# Altium schematic sheet [03]_Actuators Driver Sheet.SchDoc
size 558 x 330 mm; DocumentNumber: 3; SheetNumber: 3; SheetTotal: 5
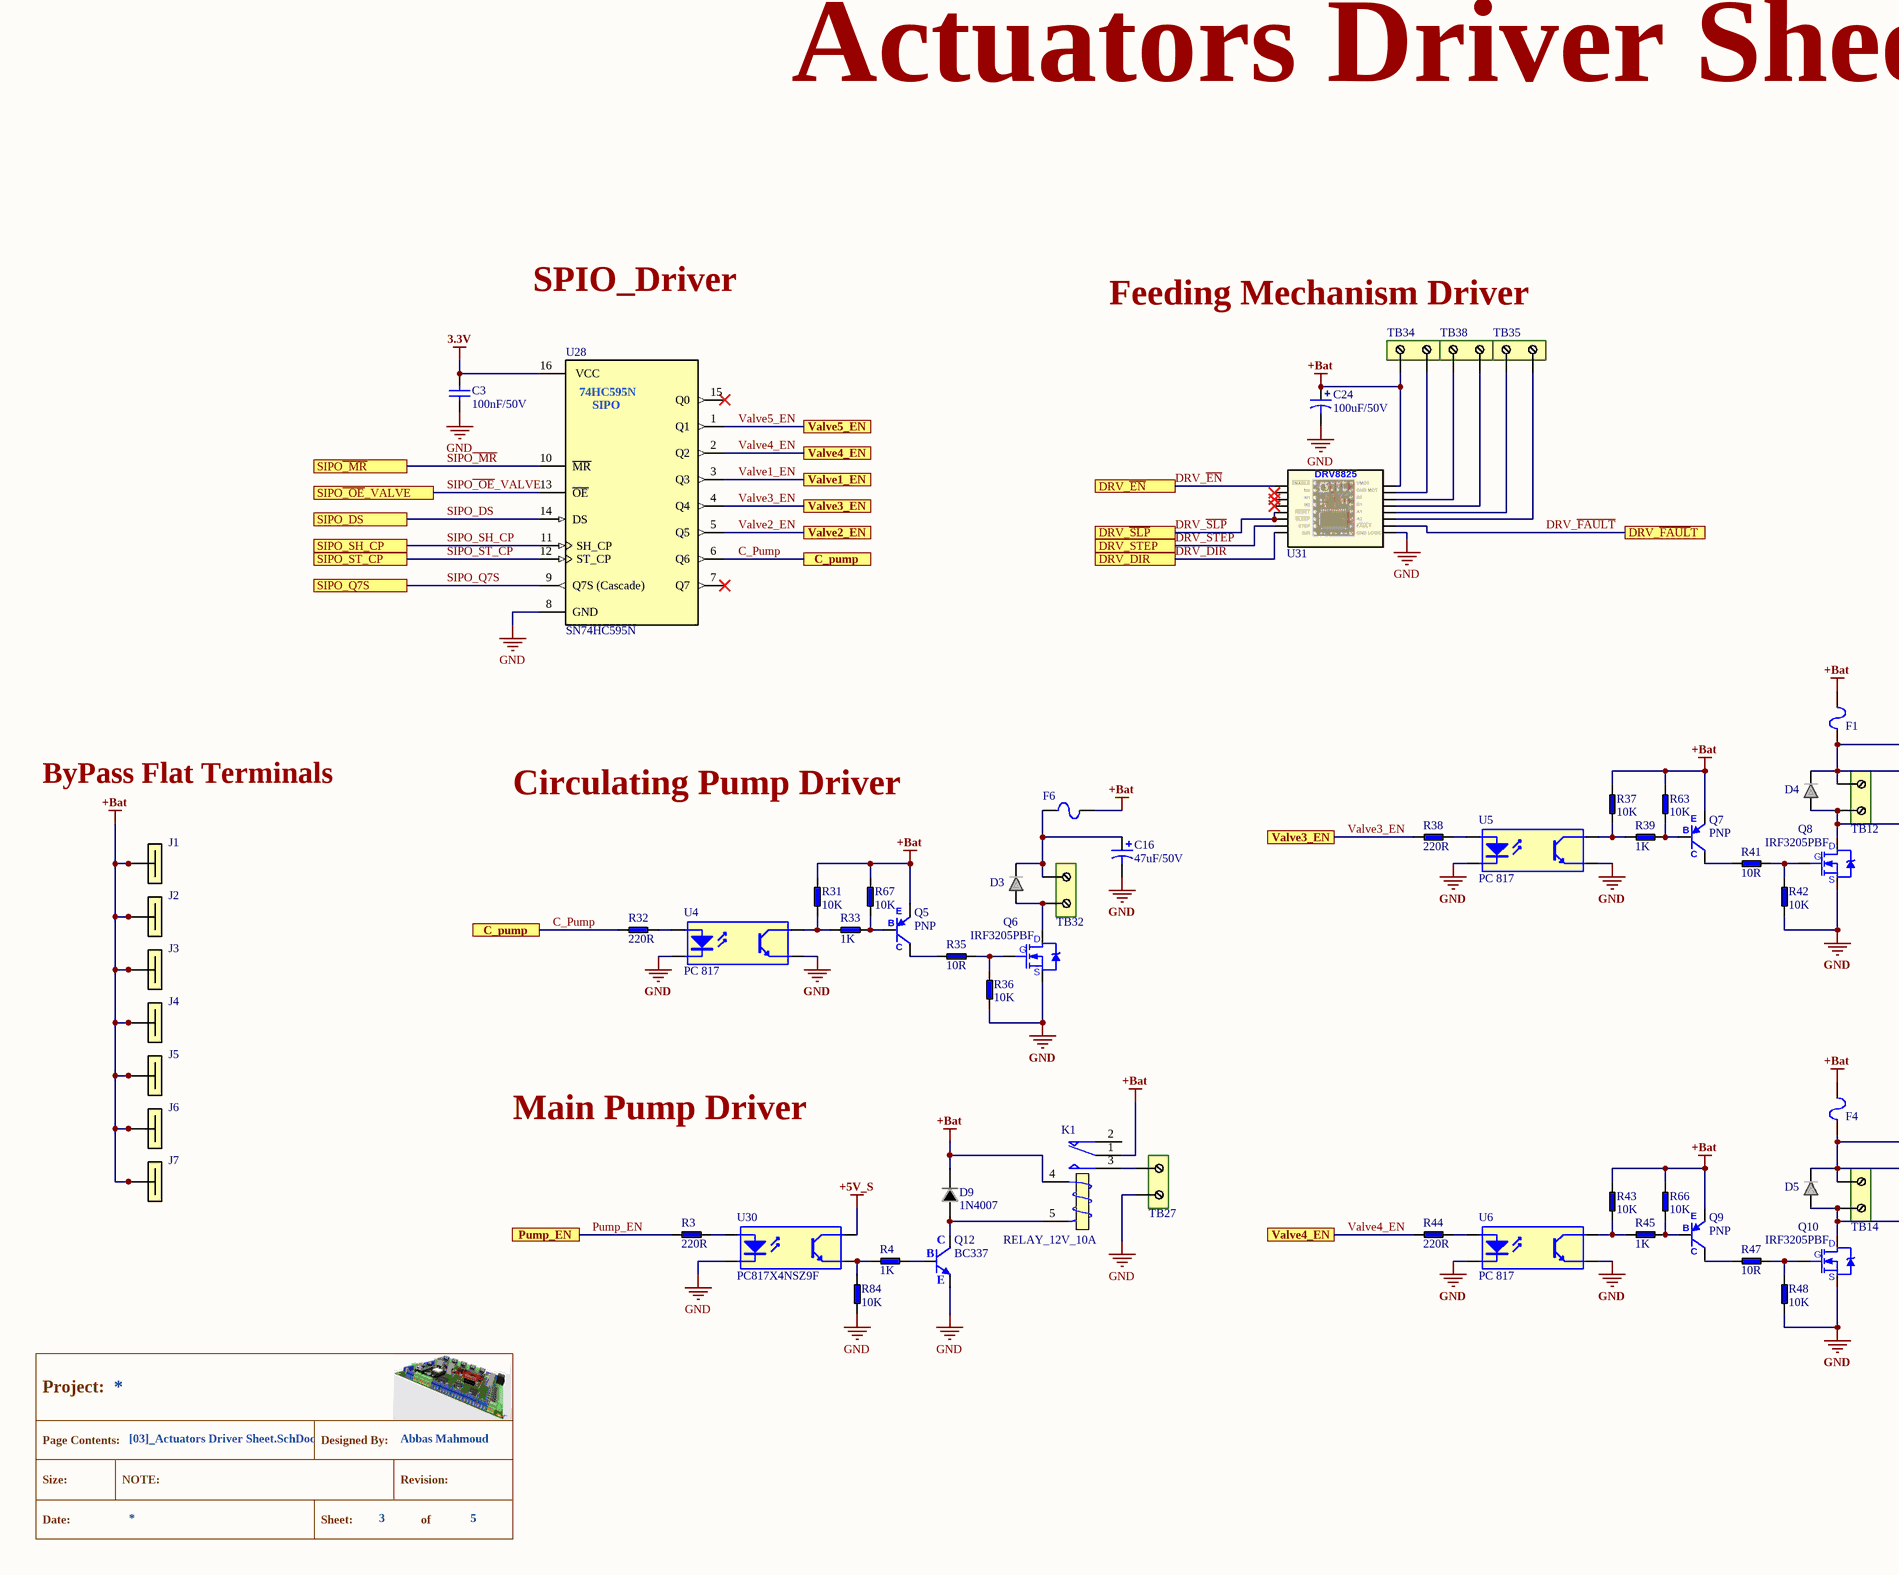
[diagram p0: [03]_Actuators Driver Sheet.SchDoc, left]
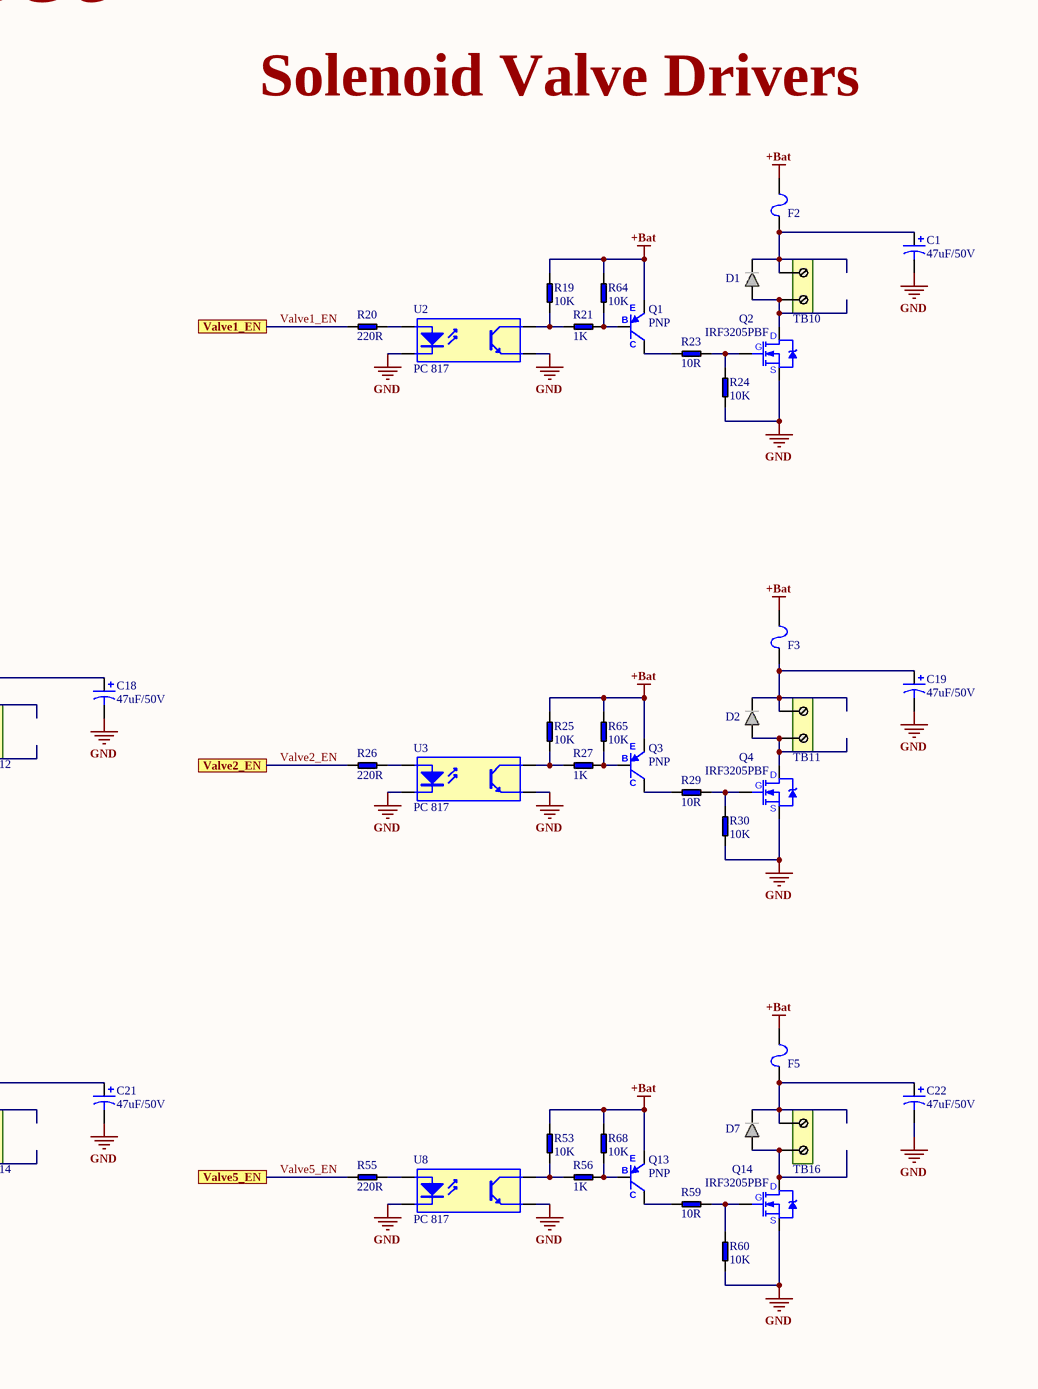
[diagram p1: [03]_Actuators Driver Sheet.SchDoc, right]

## Parts
*  Title Block  (value not drawn)  (graphical)
C1  47uF/50V  [ECAP - THT - 6.3X11X2.5MM]
C3  100nF/50V  [CCAP - PACKAGE - THT ,P = 2.54 MM]
C16  47uF/50V  [ECAP - THT - 6.3X11X2.5MM]
C18  47uF/50V  [ECAP - THT - 6.3X11X2.5MM]
C19  47uF/50V  [ECAP - THT - 6.3X11X2.5MM]
C21  47uF/50V  [ECAP - THT - 6.3X11X2.5MM]
C22  47uF/50V  [ECAP - THT - 6.3X11X2.5MM]
C24  100uF/50V  [ECAP - THT - 8X12X3.5MM]
D1  DIODE  [DIODE-1n400X_0.3]  (value not drawn)
D2  DIODE  [DIODE-1n400X_0.3]  (value not drawn)
D3  DIODE  [DIODE-1n400X_0.3]  (value not drawn)
D4  DIODE  [DIODE-1n400X_0.3]  (value not drawn)
D5  DIODE  [DIODE-1n400X_0.3]  (value not drawn)
D7  DIODE  [DIODE-1n400X_0.3]  (value not drawn)
D9  1N4007  [DIODE - THT - 7.62P - PACKAGE - DO-41]
F1  FUSES&HOLDERS  [FUSE-BLX-A HOLDER]  (value not drawn)
F2  FUSES&HOLDERS  [FUSE-BLX-A HOLDER]  (value not drawn)
F3  FUSES&HOLDERS  [FUSE-BLX-A HOLDER]  (value not drawn)
F4  FUSES&HOLDERS  [FUSE-BLX-A HOLDER]  (value not drawn)
F5  FUSES&HOLDERS  [FUSE-BLX-A HOLDER]  (value not drawn)
F6  FUSES&HOLDERS  [FUSE-BLX-A HOLDER]  (value not drawn)
J1  1217861-1  [Terminal Male Flat 6.3mm]  (value not drawn)
J2  1217861-1  [Terminal Male Flat 6.3mm]  (value not drawn)
J3  1217861-1  [Terminal Male Flat 6.3mm]  (value not drawn)
J4  1217861-1  [Terminal Male Flat 6.3mm]  (value not drawn)
J5  1217861-1  [Terminal Male Flat 6.3mm]  (value not drawn)
J6  1217861-1  [Terminal Male Flat 6.3mm]  (value not drawn)
J7  1217861-1  [Terminal Male Flat 6.3mm]  (value not drawn)
K1  RELAY_12V_10A  [RELAY - THT - 10A]
Q1  PNP  [Transistor-TO-92A]
Q2  IRF3205PBF  [Transistor/Heatsink -TO-220]
Q3  PNP  [Transistor-TO-92A]
Q4  IRF3205PBF  [Transistor/Heatsink -TO-220]
Q5  PNP  [Transistor-TO-92A]
Q6  IRF3205PBF  [Transistor/Heatsink -TO-220]
Q7  PNP  [Transistor-TO-92A]
Q8  IRF3205PBF  [Transistor/Heatsink -TO-220]
Q9  PNP  [Transistor-TO-92A]
Q10  IRF3205PBF  [Transistor/Heatsink -TO-220]
Q12  BC337  [Transistor - THT - PACKAGE - TO-92 / TO-92-3]
Q13  PNP  [Transistor-TO-92A]
Q14  IRF3205PBF  [Transistor/Heatsink -TO-220]
R3  220R  [R - THT - P5.0 - 1/4W]
R4  1K  [R - THT - P5.0 - 1/4W]
R19  10K  [R-THT_5.08mm-1/4W]
R20  220R  [R-THT_5.08mm-1/4W]
R21  1K  [R-THT_5.08mm-1/4W]
R23  10R  [R-THT_5.08mm-1/4W]
R24  10K  [R-THT_5.08mm-1/4W]
R25  10K  [R-THT_5.08mm-1/4W]
R26  220R  [R-THT_5.08mm-1/4W]
R27  1K  [R-THT_5.08mm-1/4W]
R29  10R  [R-THT_5.08mm-1/4W]
R30  10K  [R-THT_5.08mm-1/4W]
R31  10K  [R-THT_5.08mm-1/4W]
R32  220R  [R-THT_5.08mm-1/4W]
R33  1K  [R-THT_5.08mm-1/4W]
R35  10R  [R-THT_5.08mm-1/4W]
R36  10K  [R-THT_5.08mm-1/4W]
R37  10K  [R-THT_5.08mm-1/4W]
R38  220R  [R-THT_5.08mm-1/4W]
R39  1K  [R-THT_5.08mm-1/4W]
R41  10R  [R-THT_5.08mm-1/4W]
R42  10K  [R-THT_5.08mm-1/4W]
R43  10K  [R-THT_5.08mm-1/4W]
R44  220R  [R-THT_5.08mm-1/4W]
R45  1K  [R-THT_5.08mm-1/4W]
R47  10R  [R-THT_5.08mm-1/4W]
R48  10K  [R-THT_5.08mm-1/4W]
R53  10K  [R-THT_5.08mm-1/4W]
R55  220R  [R-THT_5.08mm-1/4W]
R56  1K  [R-THT_5.08mm-1/4W]
R59  10R  [R-THT_5.08mm-1/4W]
R60  10K  [R-THT_5.08mm-1/4W]
R63  10K  [R-THT_5.08mm-1/4W]
R64  10K  [R-THT_5.08mm-1/4W]
R65  10K  [R-THT_5.08mm-1/4W]
R66  10K  [R-THT_5.08mm-1/4W]
R67  10K  [R-THT_5.08mm-1/4W]
R68  10K  [R-THT_5.08mm-1/4W]
R84  10K  [R - THT - P5.0 - 1/4W]
TB10  2 Pins Pluggable  [TERMINAL BLOCK - 2 PINS - PACKAGE - PLUGGABLE - THT - P = 5.08MM - Horizontal _ Plug+Receptable]  (value not drawn)
TB11  2 Pins Pluggable  [TERMINAL BLOCK - 2 PINS - PACKAGE - PLUGGABLE - THT - P = 5.08MM - Horizontal _ Plug+Receptable]  (value not drawn)
TB12  2 Pins Pluggable  [TERMINAL BLOCK - 2 PINS - PACKAGE - PLUGGABLE - THT - P = 5.08MM - Horizontal _ Plug+Receptable]  (value not drawn)
TB14  2 Pins Pluggable  [TERMINAL BLOCK - 2 PINS - PACKAGE - PLUGGABLE - THT - P = 5.08MM - Horizontal _ Plug+Receptable]  (value not drawn)
TB16  2 Pins Pluggable  [TERMINAL BLOCK - 2 PINS - PACKAGE - PLUGGABLE - THT - P = 5.08MM - Horizontal _ Plug+Receptable]  (value not drawn)
TB27  2 Pins Pluggable  [TERMINAL BLOCK - 2 PINS - PACKAGE - PLUGGABLE - THT - P = 5.08MM - Horizontal _ Plug+Receptable]  (value not drawn)
TB32  2 Pins Pluggable  [TERMINAL BLOCK - 2 PINS - PACKAGE - PLUGGABLE - THT - P = 5.08MM - Horizontal _ Plug+Receptable]  (value not drawn)
TB34  2 Pins Pluggable  [TERMINAL BLOCK - 2 PINS - PACKAGE - PLUGGABLE - THT - P = 5.08MM - Horizontal _ Plug+Receptable]  (value not drawn)
TB35  2 Pins Pluggable  [TERMINAL BLOCK - 2 PINS - PACKAGE - PLUGGABLE - THT - P = 5.08MM - Horizontal _ Plug+Receptable]  (value not drawn)
TB38  2 Pins Pluggable  [TERMINAL BLOCK - 2 PINS - PACKAGE - PLUGGABLE - THT - P = 5.08MM - Horizontal _ Plug+Receptable]  (value not drawn)
U2  PC 817  [IC_DIP4]
U3  PC 817  [IC_DIP4]
U4  PC 817  [IC_DIP4]
U5  PC 817  [IC_DIP4]
U6  PC 817  [IC_DIP4]
U8  PC 817  [IC_DIP4]
U28  SN74HC595N  [ICB - DIP-16]
U30  PC817X4NSZ9F  [ICB - DIP-4]
U31  DRV8825  [drv8825]  (value not drawn)

## Ports
C_pump, DRV_DIR, DRV_STEP, DRV_~{EN}, DRV_~{FAUL}T, DRV_~{SLP}, Pump_EN, SIPO_DS, SIPO_Q7S, SIPO_SH_CP, SIPO_ST_CP, SIPO~{_MR}, SIPO~{_OE}_VALVE, Valve1_EN, Valve2_EN, Valve3_EN, Valve4_EN, Valve5_EN

## Nets
3.3V: C3.1 U28.16(VCC)
+5V_S: U30.4(C)
+Bat: C24.A D9.K F1.1 F2.1 F3.1 F4.1 F5.1 F6.2 J1.1 J1.2 J2.1 J2.2 J3.1 J3.2 J4.1 J4.2 J5.1 J5.2 J6.1 J6.2 J7.1 J7.2 K1.1(COM) K1.4(T1) Q1.1(E) Q3.1(E) Q5.1(E) Q7.1(E) Q9.1(E) Q13.1(E) R19.2 R25.2 R31.2 R37.2 R43.2 R53.2 R63.2 R64.2 R65.2 R66.2 R67.2 R68.2 TB34.2 U31.V_MOT
GND: C1.K C3.2 C16.K C18.K C19.K C21.K C22.K C24.K Q2.3(S) Q4.3(S) Q6.3(S) Q8.3(S) Q10.3(S) Q12.1(E) Q14.3(S) R24.1 R30.1 R36.1 R42.1 R48.1 R60.1 R84.1 TB27.2 U2.2(K) U2.3(E) U3.2(K) U3.3(E) U4.2(K) U4.3(E) U5.2(K) U5.3(E) U6.2(K) U6.3(E) U8.2(K) U8.3(E) U28.8(GND) U30.2(K) U31.GND_L
C_Pump: R32.1 U28.6(Q6) ; port C_pump
DRV_DIR: U31.DIR ; port DRV_DIR
DRV_~{EN}: U31.ENABLE ; port DRV_~{EN}
DRV_~{FAULT}: U31.FAULT ; port DRV_~{FAUL}T
DRV_~{SLP}: U31.RESET U31.SLEEP ; port DRV_~{SLP}
DRV_STEP: U31.STEP ; port DRV_STEP
Pump_EN: R3.1 ; port Pump_EN
SIPO~{_MR}: U28.10(~{MR}) ; port SIPO~{_MR}
SIPO~{_OE}_VALVE: U28.13(~{OE}) ; port SIPO~{_OE}_VALVE
SIPO_DS: U28.14(DS) ; port SIPO_DS
SIPO_Q7S: U28.9(Q7S_(Cascade)) ; port SIPO_Q7S
SIPO_SH_CP: U28.11(SH_CP) ; port SIPO_SH_CP
SIPO_ST_CP: U28.12(ST_CP) ; port SIPO_ST_CP
Valve1_EN: R20.1 U28.3(Q3) ; port Valve1_EN
Valve2_EN: R26.1 U28.5(Q5) ; port Valve2_EN
Valve3_EN: R38.1 U28.4(Q4) ; port Valve3_EN
Valve4_EN: R44.1 U28.2(Q2) ; port Valve4_EN
Valve5_EN: R55.1 U28.1(Q1) ; port Valve5_EN
NetC1_A: C1.A D1.K F2.2 TB10.2
NetC16_A: C16.A D3.K F6.1 TB32.1
NetC18_A: C18.A D4.K F1.2 TB12.2
NetC19_A: C19.A D2.K F3.2 TB11.2
NetC21_A: C21.A D5.K F4.2 TB14.2
NetC22_A: C22.A D7.K F5.2 TB16.2
NetD1_A: D1.A Q2.2(D) TB10.1
NetD2_A: D2.A Q4.2(D) TB11.1
NetD3_A: D3.A Q6.2(D) TB32.2
NetD4_A: D4.A Q8.2(D) TB12.1
NetD5_A: D5.A Q10.2(D) TB14.1
NetD7_A: D7.A Q14.2(D) TB16.1
NetD9_A: D9.A K1.5(T2) Q12.3(C)
NetK1_3: K1.3(NO) TB27.1
NetQ1_2: Q1.2(B) R21.2 R64.1
NetQ1_3: Q1.3(C) R23.1
NetQ2_1: Q2.1(G) R23.2 R24.2
NetQ3_2: Q3.2(B) R27.2 R65.1
NetQ3_3: Q3.3(C) R29.1
NetQ4_1: Q4.1(G) R29.2 R30.2
NetQ5_2: Q5.2(B) R33.2 R67.1
NetQ5_3: Q5.3(C) R35.1
NetQ6_1: Q6.1(G) R35.2 R36.2
NetQ7_2: Q7.2(B) R39.2 R63.1
NetQ7_3: Q7.3(C) R41.1
NetQ8_1: Q8.1(G) R41.2 R42.2
NetQ9_2: Q9.2(B) R45.2 R66.1
NetQ9_3: Q9.3(C) R47.1
NetQ10_1: Q10.1(G) R47.2 R48.2
NetQ12_2: Q12.2(B) R4.2
NetQ13_2: Q13.2(B) R56.2 R68.1
NetQ13_3: Q13.3(C) R59.1
NetQ14_1: Q14.1(G) R59.2 R60.2
NetR3_2: R3.2 U30.1(A)
NetR4_1: R4.1 R84.2 U30.3(E)
NetR19_1: R19.1 R21.1 U2.4(C)
NetR20_2: R20.2 U2.1(A)
NetR25_1: R25.1 R27.1 U3.4(C)
NetR26_2: R26.2 U3.1(A)
NetR31_1: R31.1 R33.1 U4.4(C)
NetR32_2: R32.2 U4.1(A)
NetR37_1: R37.1 R39.1 U5.4(C)
NetR38_2: R38.2 U5.1(A)
NetR43_1: R43.1 R45.1 U6.4(C)
NetR44_2: R44.2 U6.1(A)
NetR53_1: R53.1 R56.1 U8.4(C)
NetR55_2: R55.2 U8.1(A)
NetTB34_1: TB34.1 U31.GND_MOT
NetTB35_1: TB35.1 U31.A2
NetTB35_2: TB35.2 U31.A1
NetTB38_1: TB38.1 U31.B1
NetTB38_2: TB38.2 U31.B2

Not connected (* = marked no-connect by the designer): K1 2(NC); U28 7(Q7)* 15(Q0)*; U31 M0* M1* M2*

## Notes on the sheet
- Actuators Driver Sheet
- Solenoid Valve Drivers
- SPIO_Driver
- Feeding Mechanism Driver
- ByPass Flat Terminals
- Circulating Pump Driver
- Main Pump Driver
- (in symbol IC - SN74HC595N) 74HC595N; SIPO
- (in symbol Title Block) Project:; Page Contents:; Designed By:; Abbas Mahmoud; Size:; NOTE:; Revision:; Date:; Sheet:; of

## Library data of the parts
* = Title Block: Moatley Title Block
C1 C16 C18 C19 C21 C22 = ECAP - 47uF - 50V: 47uF ±20% 50V 6.3x11 1000Hrs @ 105℃ Radial,6.3x11mm Aluminum Electrolytic Capacitors - Leaded RoHS
C3 = CCAP - 100nF - 50V - THT - P = 2.54: 100nF -20%~+80% 50V Through Hole,P=2.54mm Ceramic Disc Capacitors RoHS; Parameter 1: *; Parameter 2: *; Parameter 3: *
C24 = ECAP - 100uF - 50V: 100uF ±20% 50V 8x12 1000Hrs @ 105℃ Radial,8x12mm Aluminum Electrolytic Capacitors - Leaded RoHS
D9 = Diode - 1N4007 - THT: 1kV 1A 1V @ 1A DO-41 Diodes - General Purpose RoHS
J1-J7 = Terminal Male Flat 6.3mm: Solder Tab Terminal; Uninsulated; Tin over Copper Plated; Straight; 6.35x0.83mm; MF: TE Connectivity; TE_purchase_URL: https://www.te.com/usa-en/product-1217861-1.html?te_bu=Cor&te_type=disp&te_campaign=seda_glo_cor-seda-global-disp-prtnr-fy19-seda-model-bom-cta_sma-317_1&elqCampaignId=32493; Package: None; Price: None; MP: 1217861-1; Availability: Unavailable; SnapEDA_Link: https://www.snapeda.com/parts/1217861-1/TE%20Connectivity%20AMP%20Connectors/view-part/?ref=snap; Value: *
K1 = Relay_12V_10A: SPDT Relay; Published: 8-Jun-2000; LatestRevisionDate: 17-Jul-2002; LatestRevisionNote: Re-released for DXP Platform.; PackageReference: MODULE5B; Publisher: Altium Limited
Q2 Q4 Q6 Q8 Q10 Q14 = IRF3205PBF: N Channel 55V 110A 4V @ 250uA 8mΩ @ 62A,10V 200W TO-220(TO-220-3) MOSFET RoHS; MF: Infineon Technologies; MP: IRF3205SPBF; Price: None; Package: D2PAK Infineon; Availability: Unavailable; SnapEDA_Link: https://www.snapeda.com/parts/IRF3205SPBF/Infineon%20Technologies/view-part/576468/?ref=snap; Value: *
Q12 = NPN - BC337: NPN 800mA 45V 625mW TO-92(TO-92-3) Transistors (NPN/PNP) RoHS
R3 = R220R - THT: 220R ±1% 1/4W ±100ppm/℃ Axial Metal Film Resistor_ Throuh Hole Technology RoHS
R4 = R1K - THT: 1K ±1% 1/4W ±100ppm/℃ Axial Metal Film Resistor_ Throuh Hole Technology RoHS
R19 R24 R25 R30 R31 R36 R37 R42 R43 R48 R53 R60 R63-R68 = R10K-THT: 10K ±1% 1/4W ±100ppm/℃ Axial Metal Film Resistor_ Throuh Hole Technology RoHS
R20 R26 R32 R38 R44 R55 = R220R-THT: 220R ±1% 1/4W ±100ppm/℃ Axial Metal Film Resistor_ Throuh Hole Technology RoHS
R21 R27 R33 R39 R45 R56 = R1K-THT: 1K ±1% 1/4W ±100ppm/℃ Axial Metal Film Resistor_ Throuh Hole Technology RoHS
R23 R29 R35 R41 R47 R59 = R10R-THT: 10R ±1% 1/4W ±100ppm/℃ Axial Metal Film Resistor_ Throuh Hole Technology RoHS
R84 = R10K - THT: 10K ±1% 1/4W ±100ppm/℃ Axial Metal Film Resistor_ Throuh Hole Technology RoHS
TB10-TB12 TB14 TB16 TB27 TB32 TB34 TB35 TB38 = Terminal Block - 2 Pins - Pluggable: Terminal Block 2 Pin 15A 300V  (28-14 AWG) P=5.08mm Through Hole Pluggable System Terminal Block RoHS
U2-U6 U8 = PC 817: 4-Pin Phototransistor Optocoupler; Published: 24-Mar-1999; LatestRevisionDate: 04-Mar-2005; LatestRevisionNote: Sch pins 3 & 4 Swapped.; DatasheetVersion: Nov-2003; PackageReference: DIP-4; Publisher: Altium Limited
U28 = IC - SN74HC595N: Serial to Parallel or Serial Shift Register Supplementary type DIP-16 Shift Registers RoHS; Manufacturer: Texas Instruments; Mfr.Part #: SN74HC595N; Package: DIP-16
U30 = IC - PC817X4NSZ9F: Optoisolator Transistor Output 5000Vrms 1 Channel 4-DIP; Manufacturer: Sharp Microelectronics; Mfr.Part #: PC817X4NSZ9F; Package: DIP-4
U31 = DRV8825: MEGAPI STEPPER MOTOR DRIVER